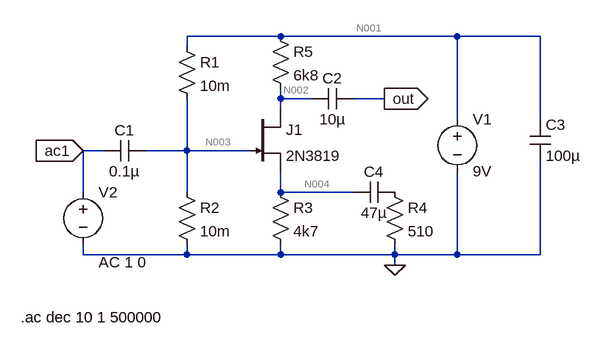
[diagram p0: schematic 2N3819_circuit_2.asc]
2N3819_circuit_2.asc, the LTspice schematic file:
Version 4.1
SHEET 1 880 680
WIRE -288 0 -432 0
WIRE -16 0 -288 0
WIRE 112 0 -16 0
WIRE -432 16 -432 0
WIRE -288 96 -288 80
WIRE -240 96 -288 96
WIRE -128 96 -176 96
WIRE -288 112 -288 96
WIRE -16 128 -16 0
WIRE 112 128 112 0
WIRE -560 176 -592 176
WIRE -432 176 -432 96
WIRE -432 176 -496 176
WIRE -336 176 -432 176
WIRE -592 240 -592 176
WIRE -432 240 -432 176
WIRE -288 240 -288 208
WIRE -176 240 -288 240
WIRE -592 336 -592 320
WIRE -432 336 -432 320
WIRE -432 336 -592 336
WIRE -288 336 -288 320
WIRE -288 336 -432 336
WIRE -112 336 -112 320
WIRE -112 336 -288 336
WIRE -16 336 -16 208
WIRE -16 336 -112 336
WIRE 112 336 112 192
WIRE 112 336 -16 336
WIRE -112 352 -112 336
FLAG -112 352 0
FLAG -592 176 ac1
IOPIN -592 176 In
FLAG -128 96 out
IOPIN -128 96 Out
SYMBOL voltage -16 112 R0
WINDOW 123 0 0 Left 0
WINDOW 39 0 0 Left 0
SYMATTR InstName V1
SYMATTR Value 9V
SYMBOL njf -336 112 R0
SYMATTR InstName J1
SYMATTR Value 2N3819
SYMBOL cap -496 160 R90
WINDOW 0 0 32 VBottom 2
WINDOW 3 32 32 VTop 2
SYMATTR InstName C1
SYMATTR Value 0.1µ
SYMBOL res -448 0 R0
SYMATTR InstName R1
SYMATTR Value 10m
SYMBOL res -448 224 R0
SYMATTR InstName R2
SYMATTR Value 10m
SYMBOL res -304 224 R0
SYMATTR InstName R3
SYMATTR Value 4k7
SYMBOL cap -176 80 R90
WINDOW 0 0 32 VBottom 2
WINDOW 3 32 32 VTop 2
SYMATTR InstName C2
SYMATTR Value 10µ
SYMBOL res -128 224 R0
SYMATTR InstName R4
SYMATTR Value 510
SYMBOL cap 96 128 R0
SYMATTR InstName C3
SYMATTR Value 100µ
SYMBOL voltage -592 224 R0
WINDOW 3 24 152 Left 2
WINDOW 123 24 124 Left 2
WINDOW 39 0 0 Left 0
SYMATTR InstName V2
SYMATTR Value ""
SYMATTR Value2 AC 1 0
SYMBOL res -304 -16 R0
SYMATTR InstName R5
SYMATTR Value 6k8
SYMBOL cap -112 224 R90
WINDOW 0 0 32 VBottom 2
WINDOW 3 32 32 VTop 2
SYMATTR InstName C4
SYMATTR Value 47µ
TEXT -688 432 Left 2 !.ac dec 10 1 500000

The netlist it stands for:
* 2N3819_circuit_2.asc
V1 N001 0 9V
J1 N002 N003 N004 2N3819
C1 N003 ac1 0.1µ
R1 N001 N003 10m
R2 N003 0 10m
R3 N004 0 4k7
C2 out N002 10µ
R4 P001 0 510
C3 N001 0 100µ
V2 ac1 0 AC 1 0
R5 N001 N002 6k8
C4 P001 N004 47µ
.model NJF NJF
.model PJF PJF
.lib standard.jft
.ac dec 10 1 500000
.backanno
.end

* Results of the author's LTspice run, read from the files saved beside the schematic
* Operating Point, zero values left out:
*   V(n001) = 9 V
*   V(n002) = 4.017 V
*   V(n003) = 4.5 V
*   V(n004) = 3.935 V
*   V(out) = 4.017 V
*   I(R1) = 450 A
*   I(R2) = 450 A
*   I(R3) = 837.2 µA
*   I(R5) = 732.8 µA
*   I(V1) = -450 A
*   Id(J1) = 732.8 µA
*   Ig(J1) = 104.4 µA
*   Is(J1) = -837.2 µA
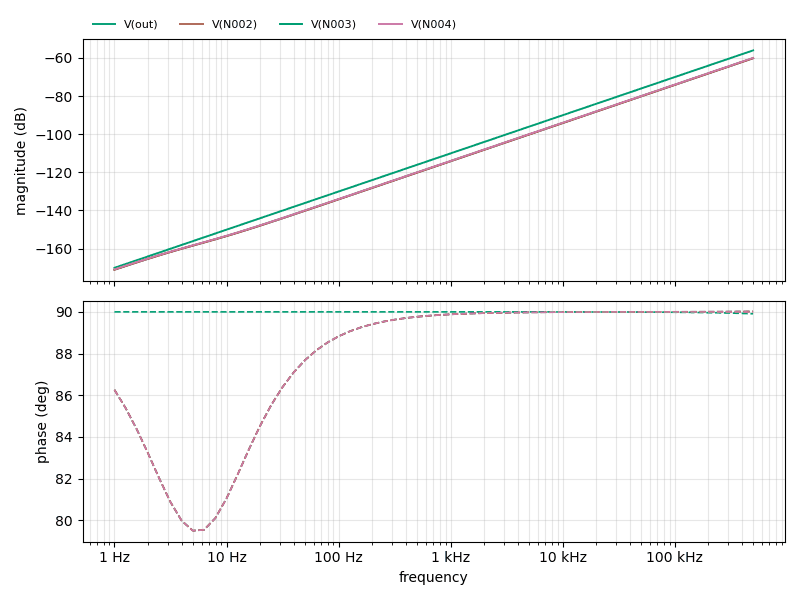
[diagram p1: AC Analysis of 2N3819_circuit_2.asc, plotted from the saved traces]
* AC Analysis, 1 run:
*   V(out): -171.03 dB at 1 Hz, -60.17 dB at 500 kHz, peak -60.17 dB at 500 kHz, 3 dB below the peak at 353.6 kHz
*   V(N002): -171.03 dB at 1 Hz, -60.17 dB at 500 kHz, peak -60.17 dB at 500 kHz, 3 dB below the peak at 353.6 kHz
*   V(N003): -170.06 dB at 1 Hz, -56.08 dB at 500 kHz, peak -56.08 dB at 500 kHz, 3 dB below the peak at 353.6 kHz
*   V(N004): -170.89 dB at 1 Hz, -60.03 dB at 500 kHz, peak -60.03 dB at 500 kHz, 3 dB below the peak at 353.6 kHz